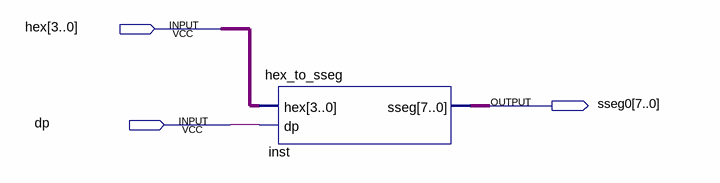
[diagram p0: schematic sheet]
// Quartus schematic top.bdf as structural Verilog: 1 symbols, 3 pins
module top (
  input  [3:0] hex,
  input  dp,
  output [7:0] sseg0
);

  hex_to_sseg inst (.hex(hex), .dp(dp), .sseg(sseg0));
endmodule
